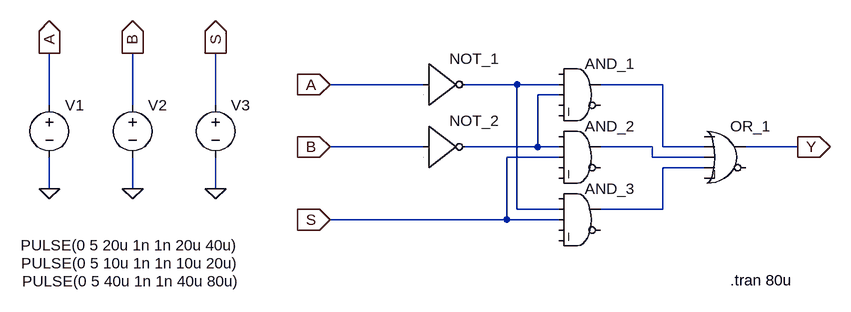
[diagram p0: schematic PLB_with_AND_OR.asc]
PLB_with_AND_OR.asc, the LTspice schematic file:
Version 4
SHEET 1 880 680
WIRE 32 112 -112 112
WIRE 176 112 96 112
WIRE 240 112 176 112
WIRE 400 112 304 112
WIRE 240 128 208 128
WIRE -544 144 -544 64
WIRE -416 144 -416 64
WIRE -288 144 -288 64
WIRE 32 208 -112 208
WIRE 208 208 208 128
WIRE 208 208 96 208
WIRE 240 208 208 208
WIRE 384 208 304 208
WIRE 400 208 400 112
WIRE 464 208 400 208
WIRE 608 208 528 208
WIRE 240 224 160 224
WIRE 384 224 384 208
WIRE 464 224 384 224
WIRE 464 240 400 240
WIRE -544 272 -544 224
WIRE -416 272 -416 224
WIRE -288 272 -288 224
WIRE 176 304 176 112
WIRE 240 304 176 304
WIRE 400 304 400 240
WIRE 400 304 304 304
WIRE 160 320 160 224
WIRE 160 320 -112 320
WIRE 240 320 160 320
FLAG -112 112 A
IOPIN -112 112 In
FLAG -112 208 B
IOPIN -112 208 In
FLAG -112 320 S
IOPIN -112 320 In
FLAG 608 208 Y
IOPIN 608 208 Out
FLAG -544 272 0
FLAG -416 272 0
FLAG -288 272 0
FLAG -544 64 A
IOPIN -544 64 Out
FLAG -416 64 B
IOPIN -416 64 Out
FLAG -288 64 S
IOPIN -288 64 Out
SYMBOL Digital\\inv 32 48 R0
SYMATTR InstName NOT_1
SYMBOL Digital\\inv 32 144 R0
SYMATTR InstName NOT_2
SYMBOL Digital\\and 272 64 R0
SYMATTR InstName AND_1
SYMBOL Digital\\and 272 160 R0
SYMATTR InstName AND_2
SYMBOL Digital\\and 272 256 R0
SYMATTR InstName AND_3
SYMBOL Digital\\or 496 160 R0
SYMATTR InstName OR_1
SYMBOL voltage -544 128 R0
WINDOW 3 -44 231 Left 2
WINDOW 123 0 0 Left 0
WINDOW 39 0 0 Left 0
SYMATTR InstName V1
SYMATTR Value PULSE(0 5 20u 1n 1n 20u 40u)
SYMBOL voltage -416 128 R0
WINDOW 3 -171 259 Left 2
WINDOW 123 0 0 Left 0
WINDOW 39 0 0 Left 0
SYMATTR InstName V2
SYMATTR Value PULSE(0 5 10u 1n 1n 10u 20u)
SYMBOL voltage -288 128 R0
WINDOW 3 -298 287 Left 2
WINDOW 123 0 0 Left 0
WINDOW 39 0 0 Left 0
SYMATTR InstName V3
SYMATTR Value PULSE(0 5 40u 1n 1n 40u 80u)
TEXT 504 413 Left 2 !.tran 80u

The netlist it stands for:
* PLB_with_AND_OR.asc
A§NOT_1 A 0 0 0 0 N001 0 0 BUF
A§NOT_2 B 0 0 0 0 N003 0 0 BUF
AND_1 0 N001 N003 0 0 0 N002 0 AND
AND_2 0 N003 S 0 0 0 N004 0 AND
AND_3 0 N001 S 0 0 0 N005 0 AND
A§OR_1 0 N002 N004 N005 0 0 Y 0 OR
V1 A 0 PULSE(0 5 20u 1n 1n 20u 40u)
V2 B 0 PULSE(0 5 10u 1n 1n 10u 20u)
V3 S 0 PULSE(0 5 40u 1n 1n 40u 80u)
.tran 80u
.backanno
.end